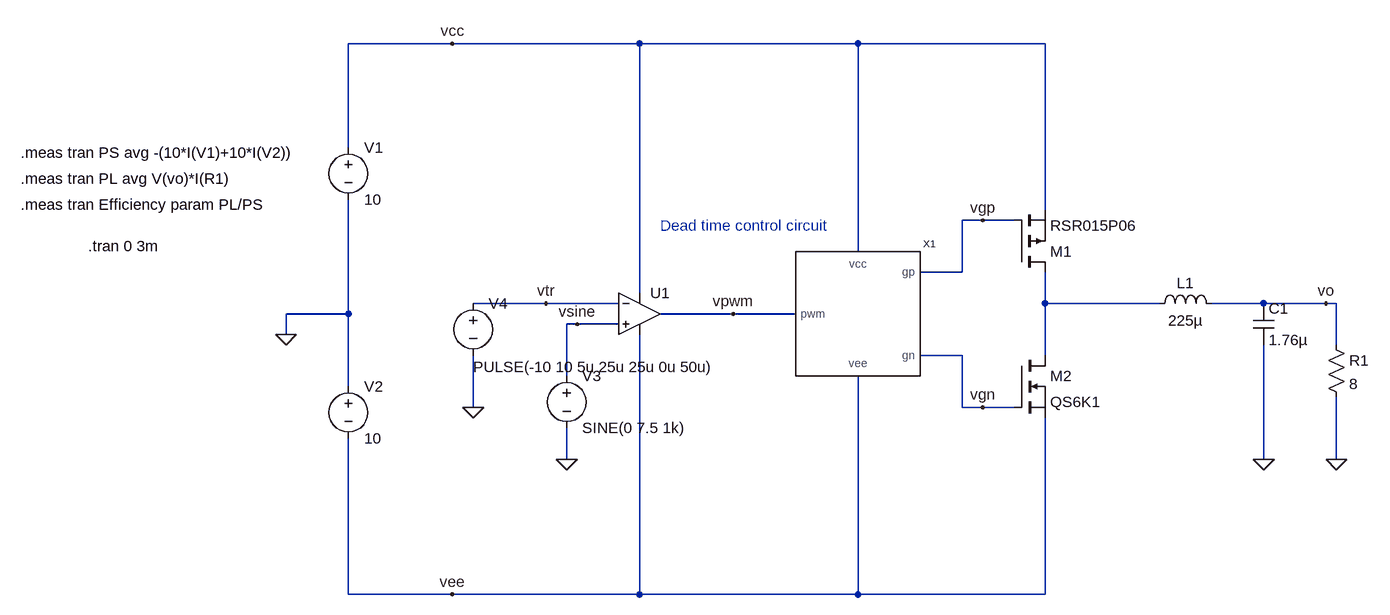
[diagram p0: schematic class-d-starter.asc]
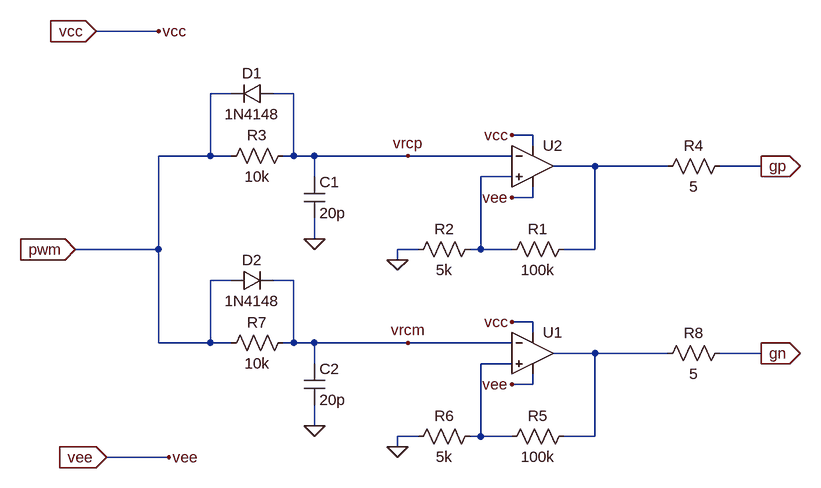
[diagram p1: sub-circuit deadtime.asc]
class-d-starter.asc, the LTspice schematic file:
Version 4
SHEET 1 1948 680
WIRE -304 -720 -464 -720
WIRE -16 -720 -304 -720
WIRE 320 -720 -16 -720
WIRE 608 -720 320 -720
WIRE -464 -560 -464 -720
WIRE 608 -464 608 -720
WIRE 512 -448 480 -448
WIRE 560 -448 512 -448
WIRE 320 -400 320 -720
WIRE 480 -368 480 -448
WIRE 480 -368 416 -368
WIRE -16 -336 -16 -720
WIRE -160 -320 -272 -320
WIRE -48 -320 -160 -320
WIRE 608 -320 608 -368
WIRE 784 -320 608 -320
WIRE 944 -320 864 -320
WIRE 1040 -320 944 -320
WIRE 1056 -320 1040 -320
WIRE -464 -304 -464 -480
WIRE -464 -304 -560 -304
WIRE 128 -304 16 -304
WIRE 224 -304 128 -304
WIRE -112 -288 -128 -288
WIRE -48 -288 -112 -288
WIRE -560 -272 -560 -304
WIRE 1056 -256 1056 -320
WIRE 480 -240 416 -240
WIRE 608 -240 608 -320
WIRE -128 -208 -128 -288
WIRE -464 -192 -464 -304
WIRE -272 -160 -272 -240
WIRE 480 -160 480 -240
WIRE 512 -160 480 -160
WIRE 560 -160 512 -160
WIRE -128 -80 -128 -128
WIRE 944 -80 944 -256
WIRE 1056 -80 1056 -176
WIRE -464 128 -464 -112
WIRE -304 128 -464 128
WIRE -16 128 -16 -272
WIRE -16 128 -304 128
WIRE 320 128 320 -208
WIRE 320 128 -16 128
WIRE 608 128 608 -144
WIRE 608 128 320 128
FLAG -560 -272 0
FLAG 1040 -320 vo
FLAG 1056 -80 0
FLAG -304 -720 vcc
FLAG -304 128 vee
FLAG 128 -304 vpwm
FLAG 512 -448 vgp
FLAG 512 -160 vgn
FLAG -272 -160 0
FLAG -128 -80 0
FLAG -160 -320 vtr
FLAG -112 -288 vsine
FLAG 944 -80 0
SYMBOL res 1040 -272 R0
SYMATTR InstName R1
SYMATTR Value 8
SYMBOL voltage -464 -576 R0
WINDOW 123 0 0 Left 2
WINDOW 39 0 0 Left 2
SYMATTR InstName V1
SYMATTR Value 10
SYMBOL voltage -464 -208 R0
WINDOW 123 0 0 Left 2
WINDOW 39 0 0 Left 2
SYMATTR InstName V2
SYMATTR Value 10
SYMBOL deadtime 336 -304 R0
SYMATTR InstName X1
SYMBOL pmos 560 -368 M180
SYMATTR InstName M1
SYMATTR Value RSR015P06
SYMBOL nmos 560 -240 R0
SYMATTR InstName M2
SYMATTR Value QS6K1
SYMBOL Voltage -128 -224 R0
SYMATTR InstName V3
SYMATTR Value SINE(0 7.5 1k)
SYMBOL Voltage -272 -336 R0
WINDOW 3 0 114 Left 2
SYMATTR InstName V4
SYMATTR Value PULSE(-10 10 5u 25u 25u 0u 50u)
SYMBOL OpAmps/UniversalOpAmp2 -16 -304 R0
SYMATTR InstName U1
SYMATTR Value2 Avol=1Meg GBW=10Gig Slew=10Gig
SYMBOL Cap 928 -320 R0
SYMATTR InstName C1
SYMATTR Value 1.76µ
SYMBOL ind 768 -304 R270
WINDOW 0 32 56 VTop 2
WINDOW 3 5 56 VBottom 2
SYMATTR InstName L1
SYMATTR Value 225µ
TEXT -864 -408 Left 2 !.tran 0 3m
TEXT -968 -552 Left 2 !.meas tran PS avg -(10*I(V1)+10*I(V2))
TEXT -968 -512 Left 2 !.meas tran PL avg V(vo)*I(R1)
TEXT -968 -472 Left 2 !.meas tran Efficiency param PL/PS
TEXT 16 -440 Left 2 ;Dead time control circuit

deadtime.asc, the sub-circuit schematic file:
Version 4
SHEET 1 880 680
WIRE -304 -128 -400 -128
WIRE -192 -32 -224 -32
WIRE -96 -32 -128 -32
WIRE 272 32 240 32
WIRE 272 48 272 32
WIRE -224 64 -224 -32
WIRE -224 64 -304 64
WIRE -192 64 -224 64
WIRE -96 64 -96 -32
WIRE -96 64 -112 64
WIRE -64 64 -96 64
WIRE 80 64 -64 64
WIRE 240 64 80 64
WIRE 368 80 304 80
WIRE 480 80 368 80
WIRE 624 80 560 80
WIRE -64 96 -64 64
WIRE 240 96 192 96
WIRE 272 128 272 112
WIRE 272 128 240 128
WIRE -64 192 -64 160
WIRE -304 208 -304 64
WIRE -304 208 -432 208
WIRE 96 208 64 208
WIRE 192 208 192 96
WIRE 192 208 176 208
WIRE 240 208 192 208
WIRE 368 208 368 80
WIRE 368 208 320 208
WIRE 64 224 64 208
WIRE -192 256 -224 256
WIRE -96 256 -128 256
WIRE 272 320 240 320
WIRE 272 336 272 320
WIRE -304 352 -304 208
WIRE -224 352 -224 256
WIRE -224 352 -304 352
WIRE -192 352 -224 352
WIRE -96 352 -96 256
WIRE -96 352 -112 352
WIRE -64 352 -96 352
WIRE 80 352 -64 352
WIRE 240 352 80 352
WIRE 368 368 304 368
WIRE 480 368 368 368
WIRE 624 368 560 368
WIRE -64 384 -64 352
WIRE 240 384 192 384
WIRE 272 416 272 400
WIRE 272 416 240 416
WIRE -64 480 -64 448
WIRE 96 496 64 496
WIRE 192 496 192 384
WIRE 192 496 176 496
WIRE 240 496 192 496
WIRE 368 496 368 368
WIRE 368 496 320 496
WIRE 64 512 64 496
WIRE -288 528 -384 528
FLAG 64 224 0
FLAG -64 192 0
FLAG 64 512 0
FLAG -64 480 0
FLAG 624 80 gp
IOPIN 624 80 Out
FLAG 624 368 gn
IOPIN 624 368 Out
FLAG -432 208 pwm
IOPIN -432 208 In
FLAG 80 64 vrcp
FLAG 80 352 vrcm
FLAG -400 -128 vcc
IOPIN -400 -128 In
FLAG -304 -128 vcc
FLAG -384 528 vee
IOPIN -384 528 In
FLAG -288 528 vee
FLAG 240 32 vcc
FLAG 240 128 vee
FLAG 240 320 vcc
FLAG 240 416 vee
SYMBOL diode -128 -48 R90
WINDOW 0 0 32 VBottom 2
WINDOW 3 32 32 VTop 2
SYMATTR InstName D1
SYMATTR Value 1N4148
SYMBOL res 336 192 R90
WINDOW 0 0 56 VBottom 2
WINDOW 3 32 56 VTop 2
SYMATTR InstName R1
SYMATTR Value 100k
SYMBOL res 192 192 R90
WINDOW 0 0 56 VBottom 2
WINDOW 3 32 56 VTop 2
SYMATTR InstName R2
SYMATTR Value 5k
SYMBOL cap -80 96 R0
SYMATTR InstName C1
SYMATTR Value 20p
SYMBOL res -96 48 R90
WINDOW 0 0 56 VBottom 2
WINDOW 3 32 56 VTop 2
SYMATTR InstName R3
SYMATTR Value 10k
SYMBOL res 576 64 R90
WINDOW 0 0 56 VBottom 2
WINDOW 3 32 56 VTop 2
SYMATTR InstName R4
SYMATTR Value 5
SYMBOL diode -192 272 R270
WINDOW 0 32 32 VTop 2
WINDOW 3 0 32 VBottom 2
SYMATTR InstName D2
SYMATTR Value 1N4148
SYMBOL res 336 480 R90
WINDOW 0 0 56 VBottom 2
WINDOW 3 32 56 VTop 2
SYMATTR InstName R5
SYMATTR Value 100k
SYMBOL res 192 480 R90
WINDOW 0 0 56 VBottom 2
WINDOW 3 32 56 VTop 2
SYMATTR InstName R6
SYMATTR Value 5k
SYMBOL cap -80 384 R0
SYMATTR InstName C2
SYMATTR Value 20p
SYMBOL res -96 336 R90
WINDOW 0 0 56 VBottom 2
WINDOW 3 32 56 VTop 2
SYMATTR InstName R7
SYMATTR Value 10k
SYMBOL res 576 352 R90
WINDOW 0 0 56 VBottom 2
WINDOW 3 32 56 VTop 2
SYMATTR InstName R8
SYMATTR Value 5
SYMBOL Opamps\\UniversalOpamp2 272 80 R0
SYMATTR InstName U2
SYMATTR Value2 Avol=1Meg GBW=10Gig Slew=10Gig
SYMATTR SpiceLine ilimit=2 rail=0 Vos=0 phimargin=45
SYMBOL Opamps\\UniversalOpamp2 272 368 R0
SYMATTR InstName U1
SYMATTR Value2 Avol=1Meg GBW=10Gig Slew=10Gig
SYMATTR SpiceLine ilimit=2 rail=0 Vos=0 phimargin=45

The netlist it stands for:
* class-d-starter.asc
R1 vo 0 8
V1 vcc 0 10
V2 0 vee 10
XX1 vpwm vgp vgn vcc vee deadtime
M1 N001 vgp vcc vcc RSR015P06
M2 N001 vgn vee vee QS6K1
V3 vsine 0 SINE(0 7.5 1k)
V4 vtr 0 PULSE(-10 10 5u 25u 25u 0u 50u)
XU1 vsine vtr vcc vee vpwm level2 Avol=1Meg GBW=10Gig Slew=10Gig Ilimit=25m Rail=0 Vos=0 En=0 Enk=0 In=0 Ink=0 Rin=500Meg  ; pins In+ In- V+ V- OUT
C1 vo 0 1.76µ
L1 N001 vo 225µ

* block symbol definitions
.subckt deadtime pwm gp gn vcc vee
D1 vrcp pwm 1N4148
R1 N001 N002 100k
R2 N002 0 5k
C1 vrcp 0 20p
R3 vrcp pwm 10k
R4 gp N001 5
D2 pwm vrcm 1N4148
R5 N003 N004 100k
R6 N004 0 5k
C2 vrcm 0 20p
R7 vrcm pwm 10k
R8 gn N003 5
XU2 N002 vrcp vcc vee N001 level.2 Avol=1Meg GBW=10Gig Slew=10Gig ilimit=2 rail=0 Vos=0 phimargin=45 en=0 enk=0 in=0 ink=0 Rin=500Meg  ; pins IN+ IN- V+ V- OUT
XU1 N004 vrcm vcc vee N003 level.2 Avol=1Meg GBW=10Gig Slew=10Gig ilimit=2 rail=0 Vos=0 phimargin=45 en=0 enk=0 in=0 ink=0 Rin=500Meg  ; pins IN+ IN- V+ V- OUT
.ends deadtime

.model D D
.lib standard.dio
.model NMOS NMOS
.model PMOS PMOS
.lib standard.mos
.tran 0 3m
.meas tran PS avg -(10*I(V1)+10*I(V2))
.meas tran PL avg V(vo)*I(R1)
.meas tran Efficiency param PL/PS
* Dead time control circuit
.lib UniversalOpamps2.sub
.lib UniversalOpAmp2.lib
.backanno
.end